# Altium schematic sheet NIXIE_3.SchDoc
size A4; PageSetup: Record=PageOptions|CenterHorizontal=True|CenterVertical=True|PrintScale=0.34|XCorrection=1.00|YCorrection=1.00|PrintKind=0|BorderSize=5000000|LeftOffset=0|BottomOffset=0|Orientation=2|PaperLength=1000|PaperWidth=1000|Scale=100|PaperSource=7|PrintQuality=-3|MediaType=1|DitherType=10|PrintScaleMode=1|PaperKind=A4|PaperIndex=9
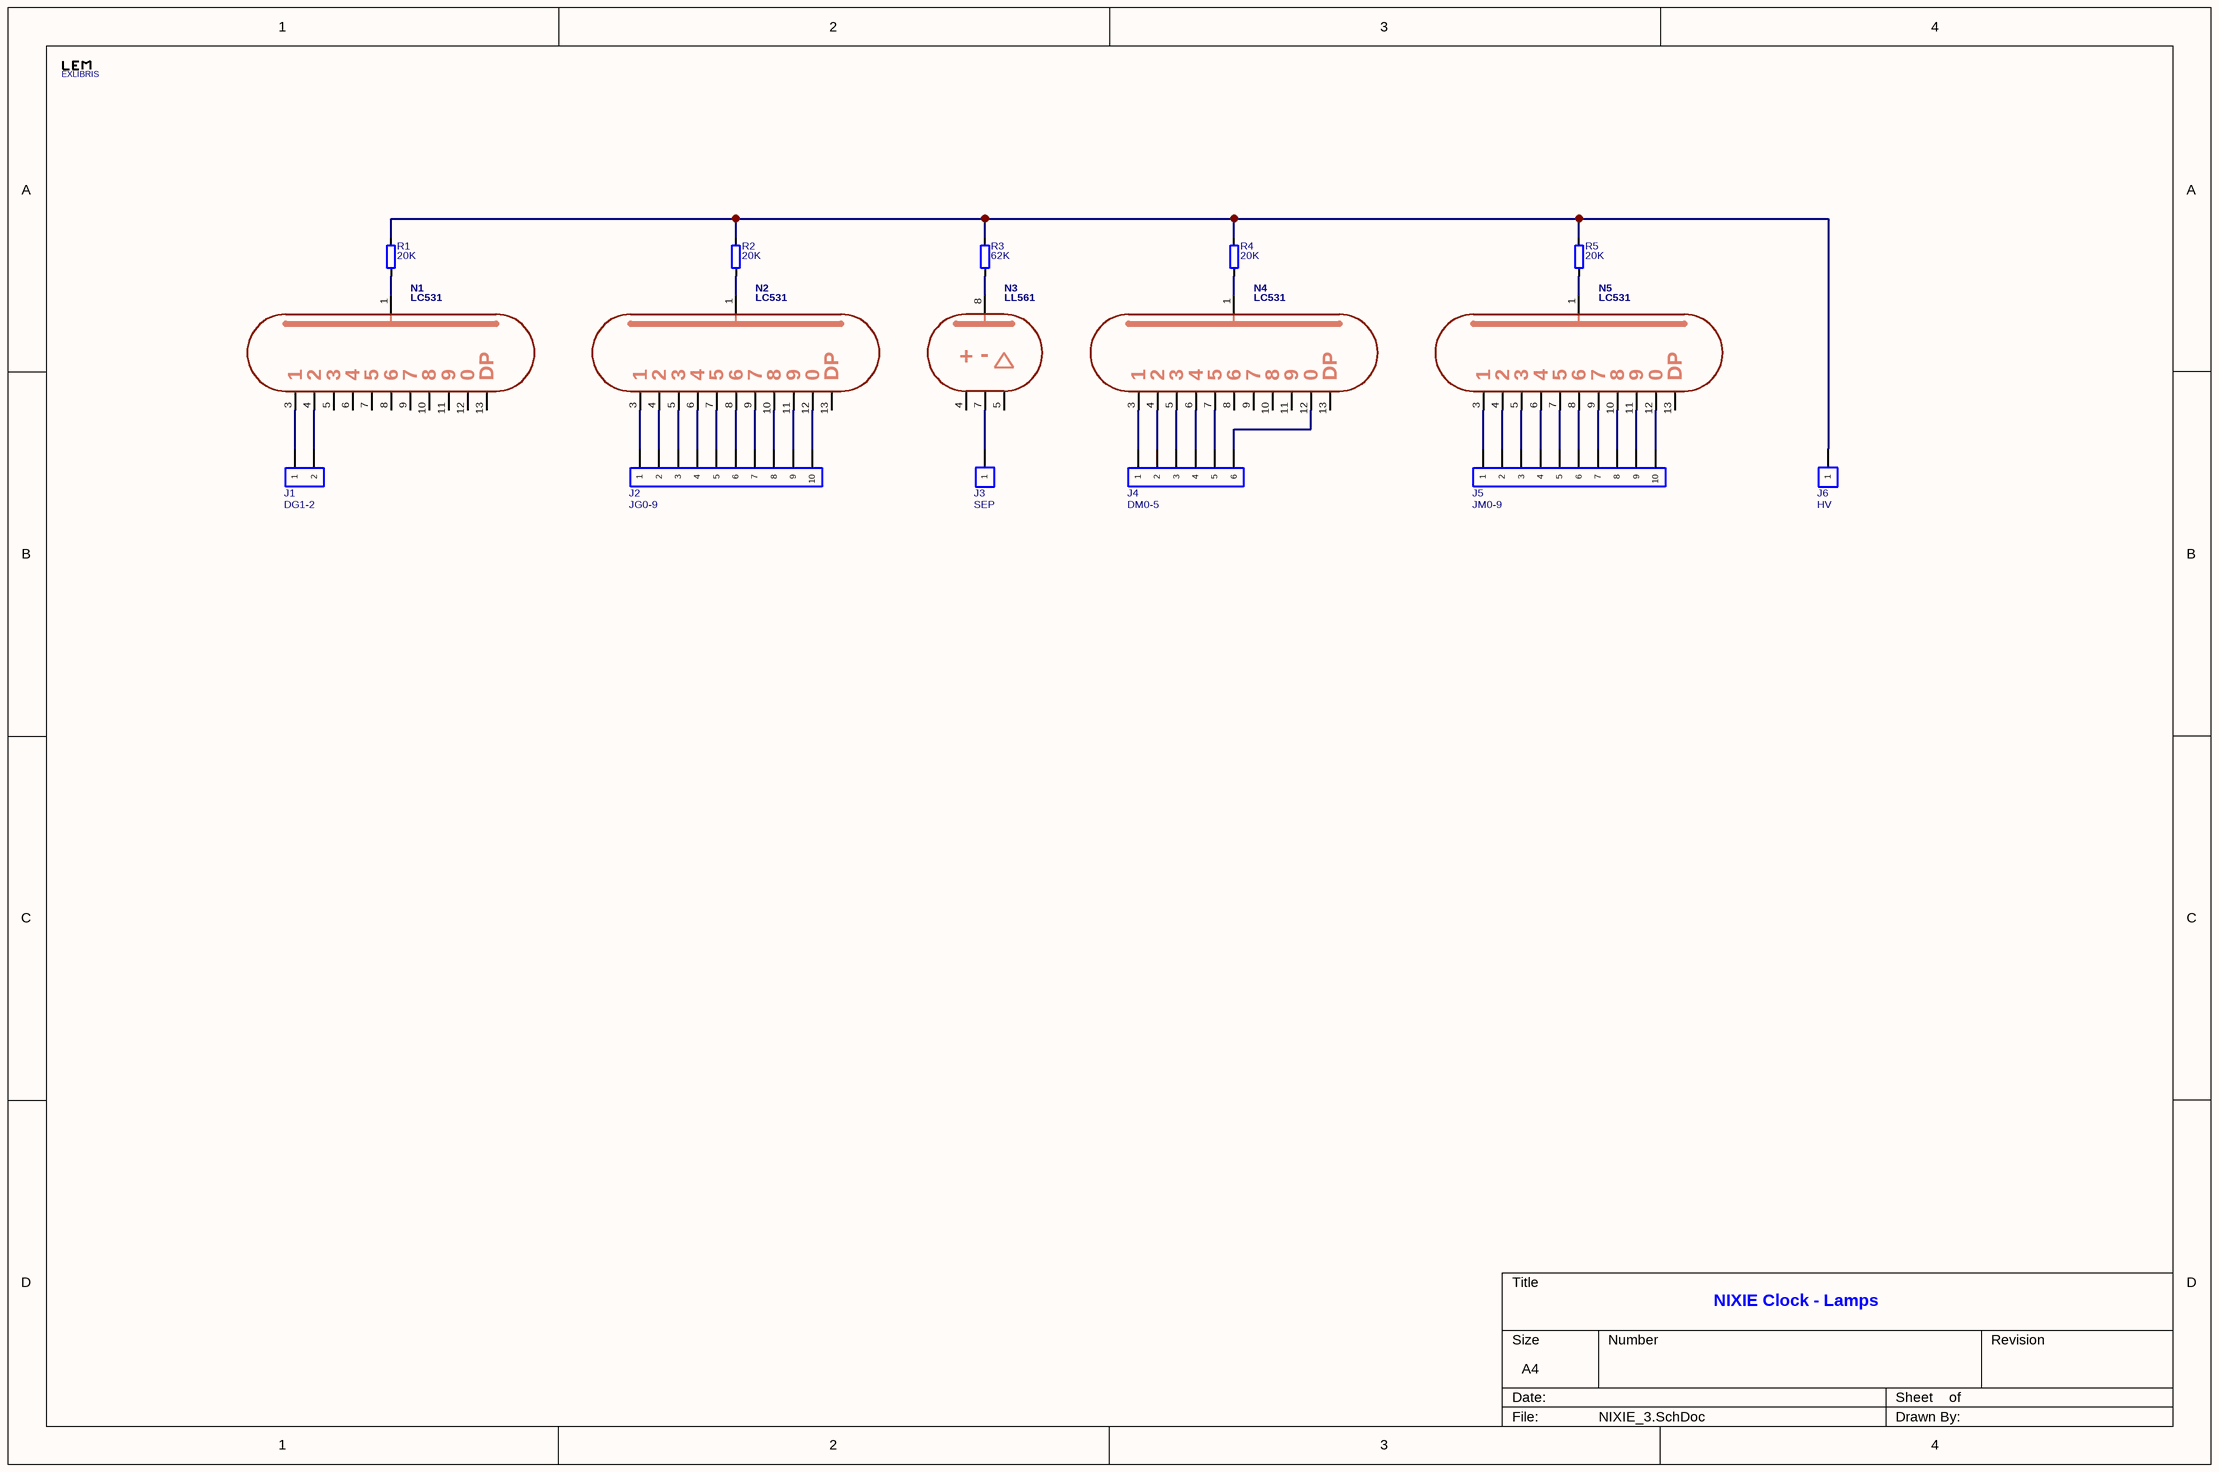
[diagram p0: NIXIE_3.SchDoc]

## Parts
EXLIBRIS  EXLIBRIS  [EXLBS_2]
J1  DG1-2  [SIL2_GP_V]
J2  JG0-9  [SIL10]
J3  SEP  [SIL1]
J4  DM0-5  [SIL6_GP_V]
J5  JM0-9  [SIL10]
J6  HV  [SIL1]
N1  LC531  [Nixie LC531]
N2  LC531  [Nixie LC531]
N3  LL561  [NIXIE LL561]
N4  LC531  [Nixie LC531]
N5  LC531  [Nixie LC531]
R1  20K  [SMD_R_0805]
R2  20K  [SMD_R_0805]
R3  62K  [SMD_R_0805]
R4  20K  [SMD_R_0805]
R5  20K  [SMD_R_0805]

## Nets
NetJ1_1: J1.1 N1.3(1)
NetJ1_2: J1.2 N1.4(2)
NetJ2_1: J2.1 N2.3(1)
NetJ2_2: J2.2 N2.4(2)
NetJ2_3: J2.3 N2.5(3)
NetJ2_4: J2.4 N2.6(4)
NetJ2_5: J2.5 N2.7(5)
NetJ2_6: J2.6 N2.8(6)
NetJ2_7: J2.7 N2.9(7)
NetJ2_8: J2.8 N2.10(8)
NetJ2_9: J2.9 N2.11(9)
NetJ2_10: J2.10 N2.12(0)
NetJ3_1: J3.1 N3.7(-)
NetJ4_1: J4.1 N4.3(1)
NetJ4_2: J4.2 N4.4(2)
NetJ4_3: J4.3 N4.5(3)
NetJ4_4: J4.4 N4.6(4)
NetJ4_5: J4.5 N4.7(5)
NetJ4_6: J4.6 N4.12(0)
NetJ5_1: J5.1 N5.3(1)
NetJ5_2: J5.2 N5.4(2)
NetJ5_3: J5.3 N5.5(3)
NetJ5_4: J5.4 N5.6(4)
NetJ5_5: J5.5 N5.7(5)
NetJ5_6: J5.6 N5.8(6)
NetJ5_7: J5.7 N5.9(7)
NetJ5_8: J5.8 N5.10(8)
NetJ5_9: J5.9 N5.11(9)
NetJ5_10: J5.10 N5.12(0)
NetJ6_1: J6.1 R1.2 R2.2 R3.2 R4.2 R5.2
NetN1_1: N1.1(A) R1.1
NetN2_1: N2.1(A) R2.1
NetN3_8: N3.8(A) R3.1
NetN4_1: N4.1(A) R4.1
NetN5_1: N5.1(A) R5.1

Not connected (* = marked no-connect by the designer): N1 5(3) 6(4) 7(5) 8(6) 9(7) 10(8) 11(9) 12(0) 13(DP); N2 13(DP); N3 4(+) 5(DELTA); N4 8(6) 9(7) 10(8) 11(9) 13(DP); N5 13(DP)

## Notes on the sheet
- NIXIE Clock - Lamps

## Library data of the parts
EXLIBRIS = EXLBR
J1 = CON 2pin: Connector 2pin
J2 J5 = CON 10pin: Connector 10 pin
J3 J6 = CON 1pin: Connector 1pin also mounting hole
J4 = CON 6pin: 6 Pin Connector
N1 N2 N4 N5 = NIXIE LC531: Lampa Numeryczna Nixie
N3 = NIXIE LL561: SIGN NEON LAMP
R1-R5 = R: Resistor